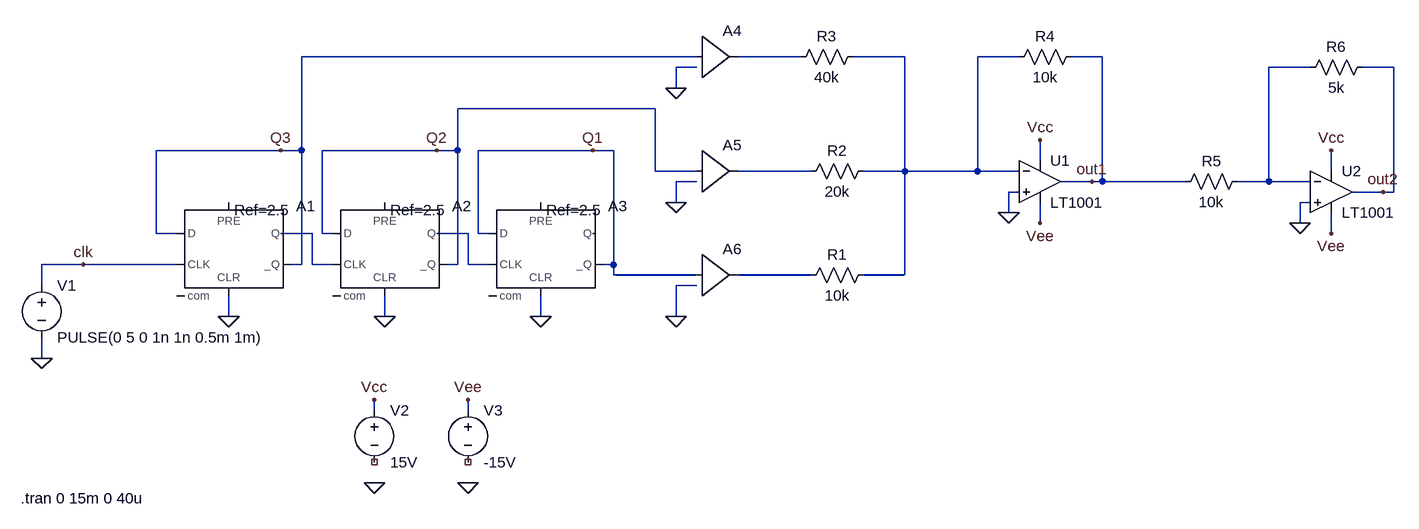
[diagram p0: schematic dac_3bit.asc]
dac_3bit.asc, the LTspice schematic file:
Version 4.1
SHEET 1 1756 680
WIRE 656 -336 48 -336
WIRE 816 -336 720 -336
WIRE 976 -336 896 -336
WIRE 1152 -336 1088 -336
WIRE 1280 -336 1232 -336
WIRE 656 -320 624 -320
WIRE 1600 -320 1536 -320
WIRE 1728 -320 1680 -320
WIRE 624 -288 624 -320
WIRE 592 -256 288 -256
WIRE 16 -192 -176 -192
WIRE 48 -192 48 -336
WIRE 48 -192 16 -192
WIRE 256 -192 80 -192
WIRE 288 -192 288 -256
WIRE 288 -192 256 -192
WIRE 496 -192 320 -192
WIRE 528 -192 496 -192
WIRE 1184 -176 1184 -208
WIRE 592 -160 592 -256
WIRE 656 -160 592 -160
WIRE 832 -160 720 -160
WIRE 976 -160 976 -336
WIRE 976 -160 912 -160
WIRE 1088 -160 1088 -336
WIRE 1088 -160 976 -160
WIRE 1152 -160 1088 -160
WIRE 1632 -160 1632 -192
WIRE 656 -144 624 -144
WIRE 1264 -144 1216 -144
WIRE 1280 -144 1280 -336
WIRE 1280 -144 1264 -144
WIRE 1408 -144 1280 -144
WIRE 1536 -144 1536 -320
WIRE 1536 -144 1488 -144
WIRE 1600 -144 1536 -144
WIRE 1152 -128 1136 -128
WIRE 1712 -128 1664 -128
WIRE 1728 -128 1728 -320
WIRE 1728 -128 1712 -128
WIRE 624 -112 624 -144
WIRE 1600 -112 1584 -112
WIRE 1136 -96 1136 -128
WIRE 1184 -80 1184 -112
WIRE 1584 -80 1584 -112
WIRE -176 -64 -176 -192
WIRE -144 -64 -176 -64
WIRE 64 -64 16 -64
WIRE 80 -64 80 -192
WIRE 96 -64 80 -64
WIRE 304 -64 256 -64
WIRE 320 -64 320 -192
WIRE 336 -64 320 -64
WIRE 1632 -64 1632 -96
WIRE -288 -16 -352 -16
WIRE -144 -16 -288 -16
WIRE 48 -16 48 -192
WIRE 48 -16 32 -16
WIRE 64 -16 64 -64
WIRE 96 -16 64 -16
WIRE 288 -16 288 -192
WIRE 288 -16 272 -16
WIRE 304 -16 304 -64
WIRE 336 -16 304 -16
WIRE 528 -16 528 -192
WIRE 528 -16 512 -16
WIRE 528 0 528 -16
WIRE 656 0 528 0
WIRE 832 0 720 0
WIRE 976 0 976 -160
WIRE 976 0 912 0
WIRE -352 16 -352 -16
WIRE 656 16 624 16
WIRE -64 64 -64 32
WIRE 176 64 176 32
WIRE 416 64 416 32
WIRE 624 64 624 16
WIRE -352 128 -352 96
WIRE 160 208 160 192
WIRE 304 208 304 192
FLAG 160 192 Vcc
FLAG 304 192 Vee
FLAG 160 320 0
FLAG 304 320 0
FLAG -352 128 0
FLAG -288 -16 clk
FLAG -64 64 0
FLAG 176 64 0
FLAG 416 64 0
FLAG 496 -192 Q1
FLAG 256 -192 Q2
FLAG 16 -192 Q3
FLAG 624 -288 0
FLAG 624 -112 0
FLAG 624 64 0
FLAG 1184 -208 Vcc
FLAG 1184 -80 Vee
FLAG 1136 -96 0
FLAG 1264 -144 out1
FLAG 1632 -192 Vcc
FLAG 1632 -64 Vee
FLAG 1584 -80 0
FLAG 1712 -128 out2
SYMBOL voltage -352 0 R0
WINDOW 123 0 0 Left 0
WINDOW 39 0 0 Left 0
SYMATTR InstName V1
SYMATTR Value PULSE(0 5 0 1n 1n 0.5m 1m)
SYMBOL voltage 160 192 R0
WINDOW 123 0 0 Left 0
WINDOW 39 0 0 Left 0
SYMATTR InstName V2
SYMATTR Value 15V
SYMBOL voltage 304 192 R0
WINDOW 123 0 0 Left 0
WINDOW 39 0 0 Left 0
SYMATTR InstName V3
SYMATTR Value -15V
SYMBOL Digital\\dflop -64 -112 R0
WINDOW 3 8 12 Left 2
SYMATTR InstName A1
SYMATTR Value Ref=2.5
SYMATTR Value2 Vhigh=5; Vlow=0
SYMATTR SpiceLine Td=20n Trise=10n Tfall=10n
SYMATTR SpiceLine2 tripdt=5n
SYMBOL Digital\\buf1 656 -400 R0
SYMATTR InstName A4
SYMATTR Value2 Vhigh=5 Vlow=0
SYMATTR SpiceLine td=10n
SYMBOL res 928 -16 R90
WINDOW 0 0 56 VBottom 2
WINDOW 3 32 56 VTop 2
SYMATTR InstName R1
SYMATTR Value 10k
SYMBOL res 928 -176 R90
WINDOW 0 0 56 VBottom 2
WINDOW 3 32 56 VTop 2
SYMATTR InstName R2
SYMATTR Value 20k
SYMBOL res 912 -352 R90
WINDOW 0 0 56 VBottom 2
WINDOW 3 32 56 VTop 2
SYMATTR InstName R3
SYMATTR Value 40k
SYMBOL OpAmps\\LT1001 1184 -208 R0
SYMATTR InstName U1
SYMBOL res 1248 -352 R90
WINDOW 0 0 56 VBottom 2
WINDOW 3 32 56 VTop 2
SYMATTR InstName R4
SYMATTR Value 10k
SYMBOL res 1504 -160 R90
WINDOW 0 0 56 VBottom 2
WINDOW 3 32 56 VTop 2
SYMATTR InstName R5
SYMATTR Value 10k
SYMBOL OpAmps\\LT1001 1632 -192 R0
SYMATTR InstName U2
SYMBOL res 1696 -336 R90
WINDOW 0 0 56 VBottom 2
WINDOW 3 32 56 VTop 2
SYMATTR InstName R6
SYMATTR Value 5k
SYMBOL Digital\\dflop 176 -112 R0
WINDOW 3 8 12 Left 2
SYMATTR InstName A2
SYMATTR Value Ref=2.5
SYMATTR Value2 Vhigh=5; Vlow=0
SYMATTR SpiceLine Td=20n Trise=10n Tfall=10n
SYMATTR SpiceLine2 tripdt=5n
SYMBOL Digital\\dflop 416 -112 R0
WINDOW 3 8 12 Left 2
SYMATTR InstName A3
SYMATTR Value Ref=2.5
SYMATTR Value2 Vhigh=5; Vlow=0
SYMATTR SpiceLine Td=20n Trise=10n Tfall=10n
SYMATTR SpiceLine2 tripdt=5n
SYMBOL Digital\\buf1 656 -224 R0
SYMATTR InstName A5
SYMATTR Value2 Vhigh=5 Vlow=0
SYMATTR SpiceLine td=10n
SYMBOL Digital\\buf1 656 -64 R0
SYMATTR InstName A6
SYMATTR Value2 Vhigh=5 Vlow=0
SYMATTR SpiceLine td=10n
TEXT -384 344 Left 2 !.tran 0 15m 0 40u

The netlist it stands for:
* dac_3bit.asc
V1 clk 0 PULSE(0 5 0 1n 1n 0.5m 1m)
V2 Vcc NC_01 15V
V3 Vee NC_02 -15V
A1 Q3 0 clk 0 0 Q3 N005 0 DFLOP Ref=2.5 Vhigh=5; Vlow=0 Td=20n Trise=10n Tfall=10n tripdt=5n
A4 Q3 0 0 0 0 0 N001 0 BUF Vhigh=5 Vlow=0 td=10n
R1 N002 N007 10k
R2 N002 N004 20k
R3 N002 N001 40k
X§U1 0 N002 Vcc Vee out1 LT1001  ; pins In+ In- V+ V- OUT
R4 out1 N002 10k
R5 N003 out1 10k
X§U2 0 N003 Vcc Vee out2 LT1001  ; pins In+ In- V+ V- OUT
R6 out2 N003 5k
A2 Q2 0 N005 0 0 Q2 N006 0 DFLOP Ref=2.5 Vhigh=5; Vlow=0 Td=20n Trise=10n Tfall=10n tripdt=5n
A3 Q1 0 N006 0 0 Q1 0 0 DFLOP Ref=2.5 Vhigh=5; Vlow=0 Td=20n Trise=10n Tfall=10n tripdt=5n
A5 Q2 0 0 0 0 0 N004 0 BUF Vhigh=5 Vlow=0 td=10n
A6 Q1 0 0 0 0 0 N007 0 BUF Vhigh=5 Vlow=0 td=10n
.tran 0 15m 0 40u
.lib LTC.lib
.backanno
.end